# EAGLE schematic main_v20 (EAGLE 9.6.2)
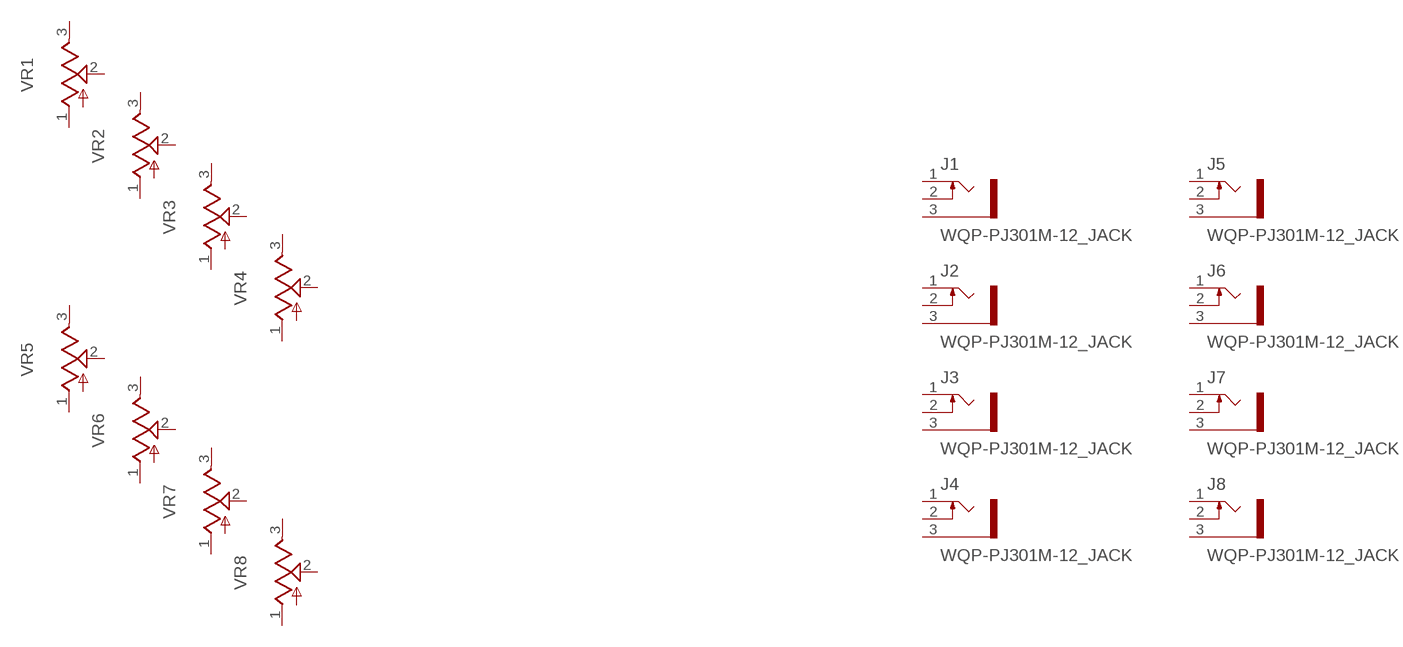
[diagram p0: schematic, sheet 1]

## Parts
DISP1  OLED_130_SCREW  [OLED_130_SCREW]  (not placed on a sheet)
J1  WQP-PJ301M-12_JACK  [WQP-PJ301M-12_JACK]
J2  WQP-PJ301M-12_JACK  [WQP-PJ301M-12_JACK]
J3  WQP-PJ301M-12_JACK  [WQP-PJ301M-12_JACK]
J4  WQP-PJ301M-12_JACK  [WQP-PJ301M-12_JACK]
J5  WQP-PJ301M-12_JACK  [WQP-PJ301M-12_JACK]
J6  WQP-PJ301M-12_JACK  [WQP-PJ301M-12_JACK]
J7  WQP-PJ301M-12_JACK  [WQP-PJ301M-12_JACK]
J8  WQP-PJ301M-12_JACK  [WQP-PJ301M-12_JACK]
VR1  9MM_V  [9MM_V]
VR2  9MM_V  [9MM_V]
VR3  9MM_V  [9MM_V]
VR4  9MM_V  [9MM_V]
VR5  9MM_V  [9MM_V]
VR6  9MM_V  [9MM_V]
VR7  9MM_V  [9MM_V]
VR8  9MM_V  [9MM_V]
Unconnected: J1.1 J1.2 J1.3 J2.1 J2.2 J2.3 J3.1 J3.2 J3.3 J4.1 J4.2 J4.3 J5.1 J5.2 J5.3 J6.1 J6.2 J6.3 J7.1 J7.2 J7.3 J8.1 J8.2 J8.3 VR1.1 VR1.2 VR1.3 VR2.1 VR2.2 VR2.3 VR3.1 VR3.2 VR3.3 VR4.1 VR4.2 VR4.3 VR5.1 VR5.2 VR5.3 VR6.1 VR6.2 VR6.3 VR7.1 VR7.2 VR7.3 VR8.1 VR8.2 VR8.3

## Library data of the parts
DISP1 = og_display:OLED_130_SCREW
J1-J8 = og_conn:WQP-PJ301M-12_JACK
VR1-VR8 = og_pot:9MM_V